# EasyEDA schematic 1-Schematic_P4_WeatherStation.json
TITLE: P4_WeatherStation; REV: 1.0; Date: 2019-08-07; Sheet: 1/1; Drawn By: Francisco Moreno; Company: Universidad de Sevilla
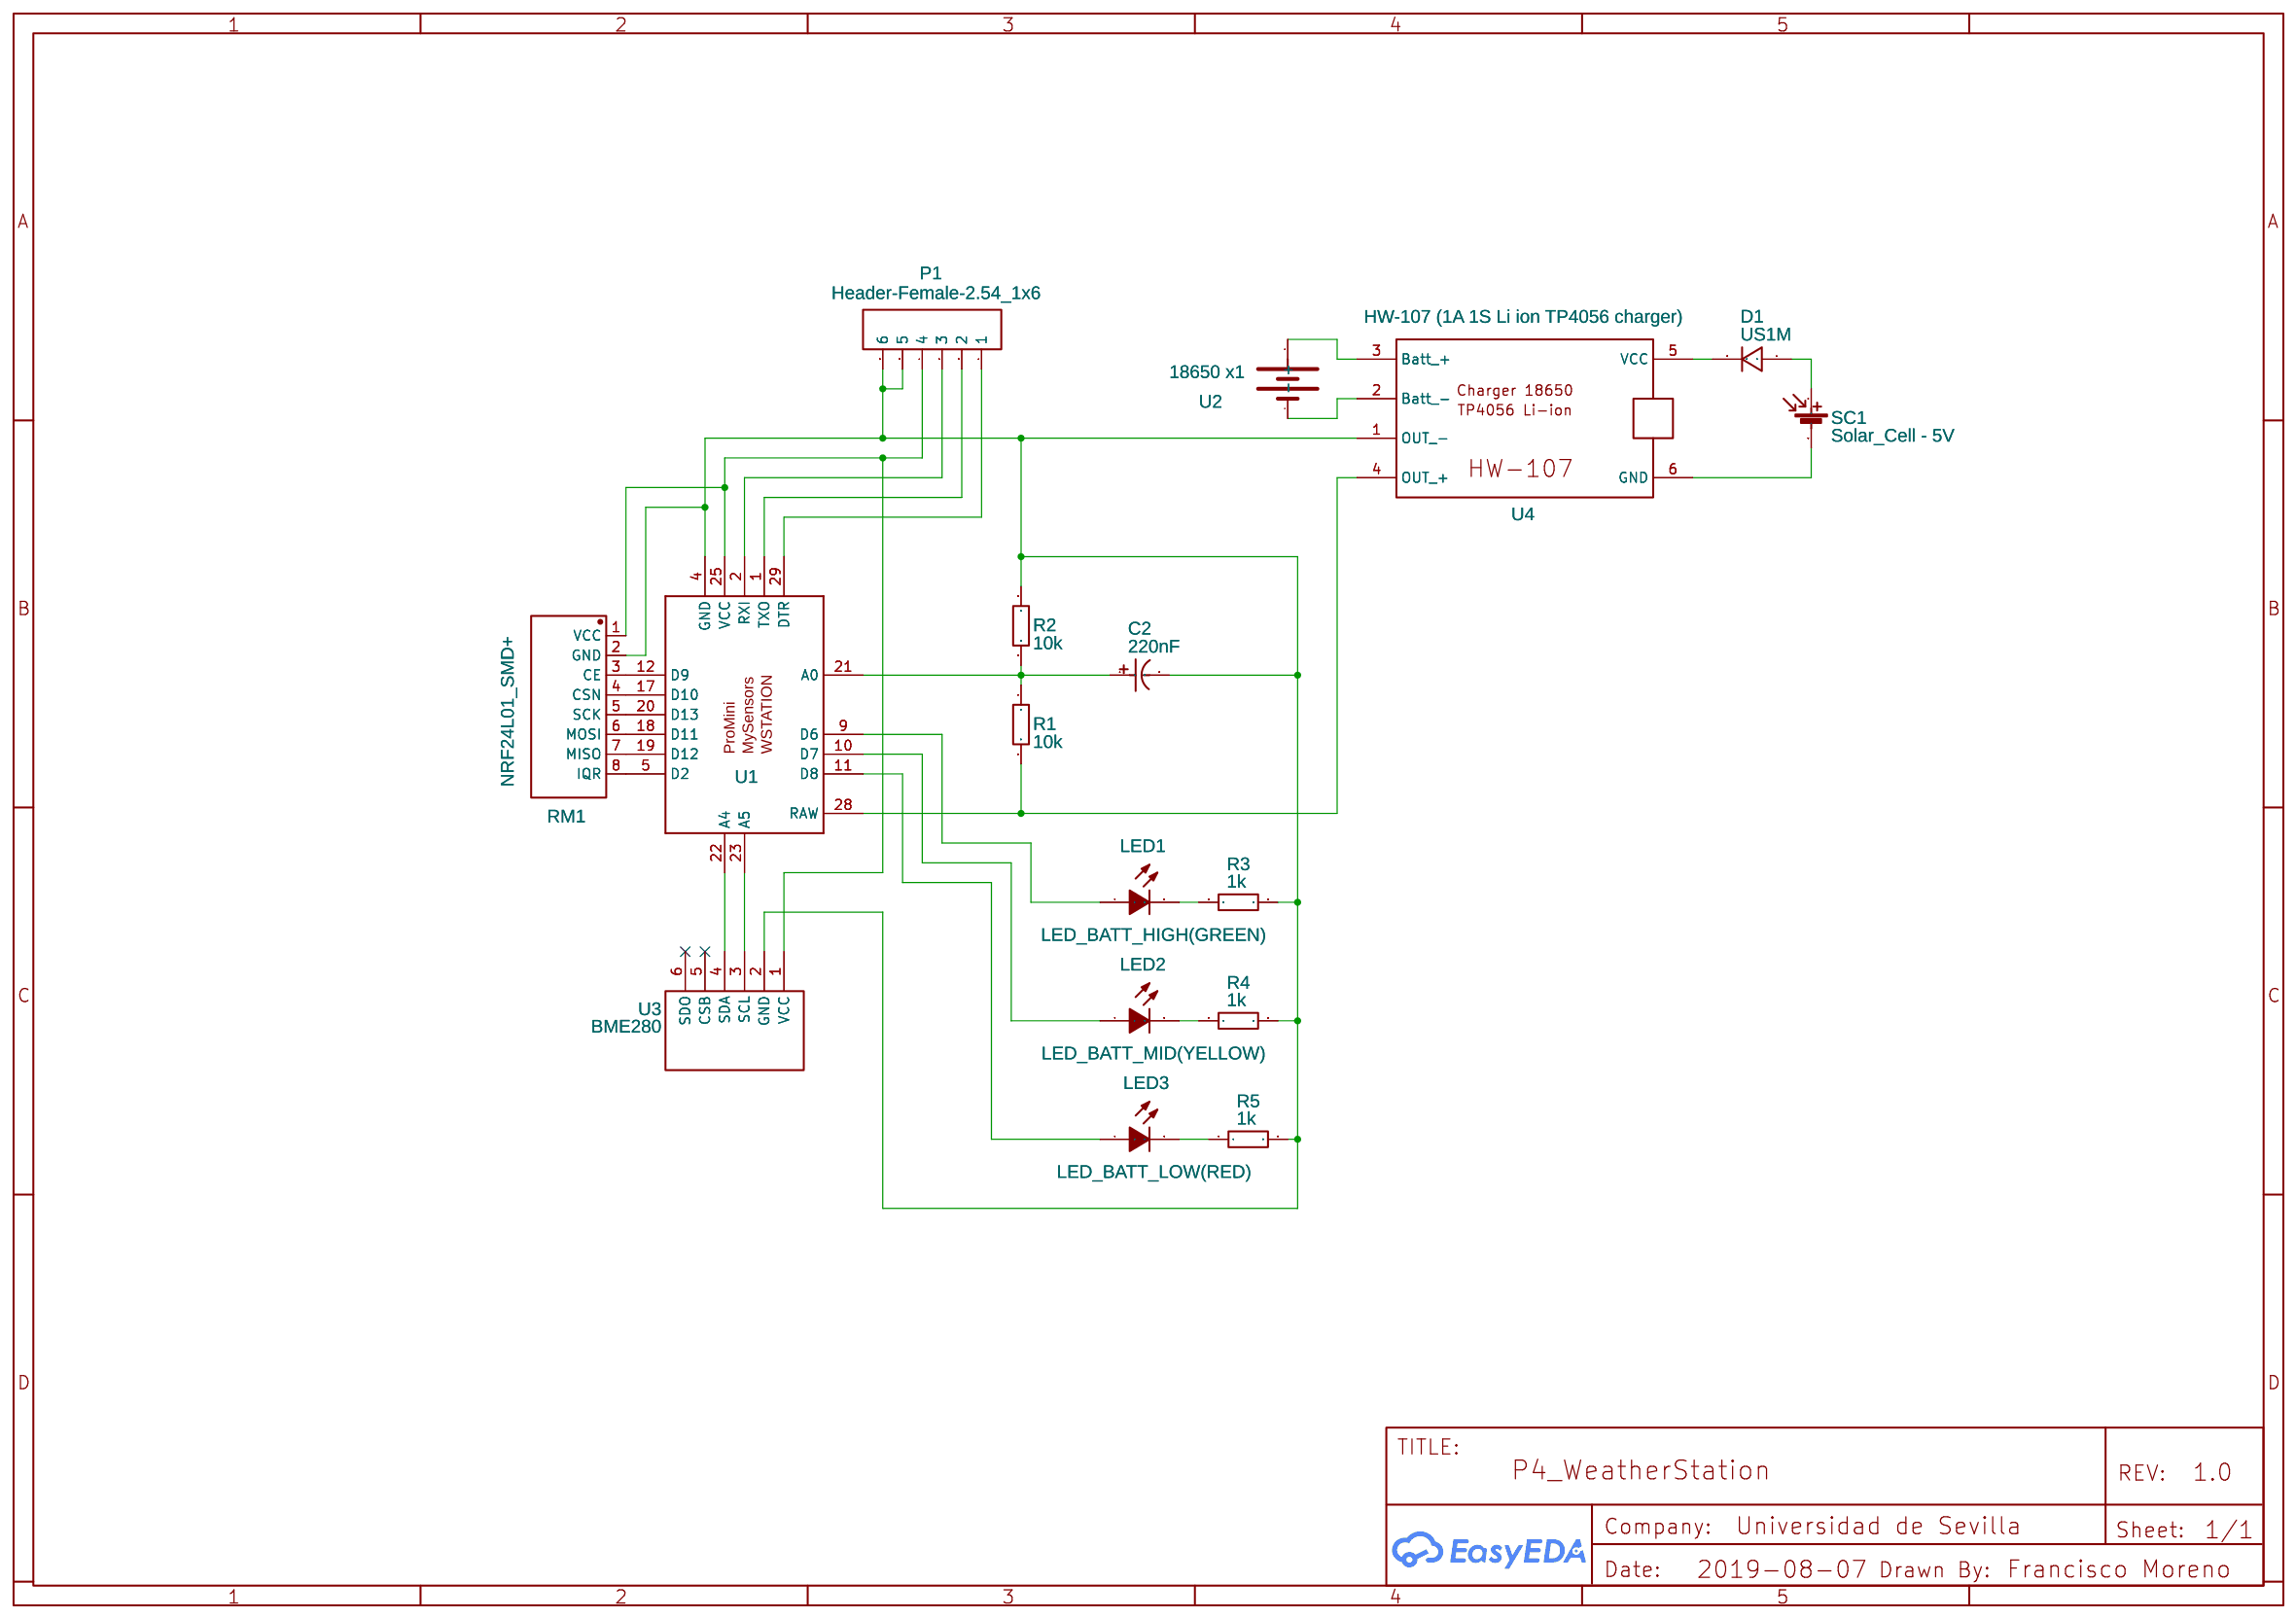
[diagram p0: schematic sheet]

## Parts
C2  220nF  [CAP-D5.0XF2.0]
D1  US1M  [SMA(DO-214AC)]
LED1  LED_BATT_HIGH(GREEN)  [LED-0603]
LED2  LED_BATT_MID(YELLOW)  [LED-0603]
LED3  LED_BATT_LOW(RED)  [LED-0603]
P1  Header-Female-2.54_1x6  [HDR-6X1/2.54]
R1  10k  [1206]
R2  10k  [1206]
R3  1k  [1206]
R4  1k  [1206]
R5  1k  [1206]
RM1  NRF24L01_SMD+  [NRF24L01_SMD+]
SC1  Solar_Cell - 5V  [SOLAR_PANEL_5V]
U1  ArduinoProMini - MySensors(WStation)  [PROMINI_MYSENSORS_PINS(WSTATION)]
U2  18650 x1  [18650-HOLDERX1]
U3  BME280  [BME280 6PINS SIPPY]
U4  HW-107 (1A 1S Li ion TP4056 charger)  [HW-107 ( 1A 1S LI ION CHARGER 18650)]

## Library data of the parts
C2 = 0.22uF 50V 5*11: Supplier: LCSC; Manufacturer: ValuePro; Supplier Part: C45096
D1 = -: Supplier Part: C181135; Supplier: LCSC; Manufacturer: Hottech; Contributor: LCSC
LED1 = -: Supplier: LCSC; Manufacturer: Foshan NationStar Optoelectronics; Manufacturer Part: FC-DA1608UGK-520D10; image: //image.lceda.cn/szlcsc/C84267.jpg; Supplier Part: C84267; LCSC Assembly: Yes; SMT Type: Extend
LED2 = -: Supplier: LCSC; Manufacturer: Foshan NationStar Optoelectronics; Manufacturer Part: FC-DA1608HYK-588J; Supplier Part: C84268; LCSC Assembly: Yes; SMT Type: Extend
LED3 = -: Supplier: LCSC; Manufacturer: Foshan NationStar Optoelectronics; Manufacturer Part: FC-DA1608HRK-620D; Supplier Part: C84263
P1 = -: Supplier: LCSC; Manufacturer: BOOMELE; Manufacturer Part: Female header 1*6p; Supplier Part: C40877
R1 R2 = 1206W4F2200T5E: Supplier: LCSC; Manufacturer: FH; Manufacturer Part: RS-05K103JT; Supplier Part: C115295; LCSC Assembly: Yes; SMT Type: Extend
R3-R5 = 1206W4F2200T5E: Supplier: LCSC; Manufacturer: UniOhm; Manufacturer Part: 1206W4J0102T5E; Supplier Part: C1469; LCSC Assembly: Yes; SMT Type: Extend
RM1 = -: Supplier: LCSC; Manufacturer Part: ?; Contributor: tiana
SC1 = -: Contributor: KiCAD; license: https://www.gnu.org/licenses/lgpl-2.1.html; Package Display: No
U1 = -: Manufacturer Part: New SchematicLib; Contributor: framortej; Link: https://robotdyn.ru/catalog/arduino/boards/promini_atmega328p_compatible_with_arduino_mini.html
U2 = -: Battery Holder; Contributor: framortej
U3 = -: Contributor: David Lochlin
U4 = -: link: https://www.ebay.com/itm/2PCS-5V-1A-USB-18650-Lithium-Battery-Charging-Board-Module-Protection-TP4056/221483898858?hash=item33917817ea:g:CE4AAOSwj9lZuLLw; Contributor: framortej

## Nets
Net-(C2-1): C2.1 R1.1 R2.2 U1.21(A0)
Net-(C2-2): C2.2 P1.5 P1.6 R2.1 R3.2 R4.2 R5.2 RM1.2(GND) U1.4(GND) U3.2(GND) U4.1(OUT -)
Net-(D1-1): D1.1 SC1.1(+)
Net-(D1-2): D1.2 U4.5(VCC)
Net-(LED1-1): LED1.1(A) U1.9(D6)
Net-(LED1-2): LED1.2(K) R3.1
Net-(LED2-1): LED2.1(A) U1.10(D7)
Net-(LED2-2): LED2.2(K) R4.1
Net-(LED3-1): LED3.1(A) U1.11(D8)
Net-(LED3-2): LED3.2(K) R5.1
Net-(P1-1): P1.1 U1.29(DTR)
Net-(P1-2): P1.2 U1.1(TXO)
Net-(P1-3): P1.3 U1.2(RXI)
Net-(P1-4): P1.4 RM1.1(VCC) U1.25(VCC) U3.1(VCC)
Net-(R1-2): R1.2 U1.28(RAW) U4.4(OUT +)
Net-(RM1-3): RM1.3(CE) U1.12(D9)
Net-(RM1-4): RM1.4(CSN) U1.17(D10)
Net-(RM1-5): RM1.5(SCK) U1.20(D13)
Net-(RM1-6): RM1.6(MOSI) U1.18(D11)
Net-(RM1-7): RM1.7(MISO) U1.19(D12)
Net-(RM1-8): RM1.8(IQR) U1.5(D2)
Net-(SC1-2): SC1.2(-) U4.6(GND)
Net-(U1-22): U1.22(A4) U3.4(SDA)
Net-(U1-23): U1.23(A5) U3.3(SCL)
Net-(U2-+): U2.+ U4.3(Batt +)
Net-(U2--): U2.- U4.2(Batt -)

Not connected (* = marked no-connect by the designer): U3 5(CSB)* 6(SDO)*
